# Altium schematic sheet INV.5KW.OffGrid MPS.SchDoc
size 800 x 800 mm
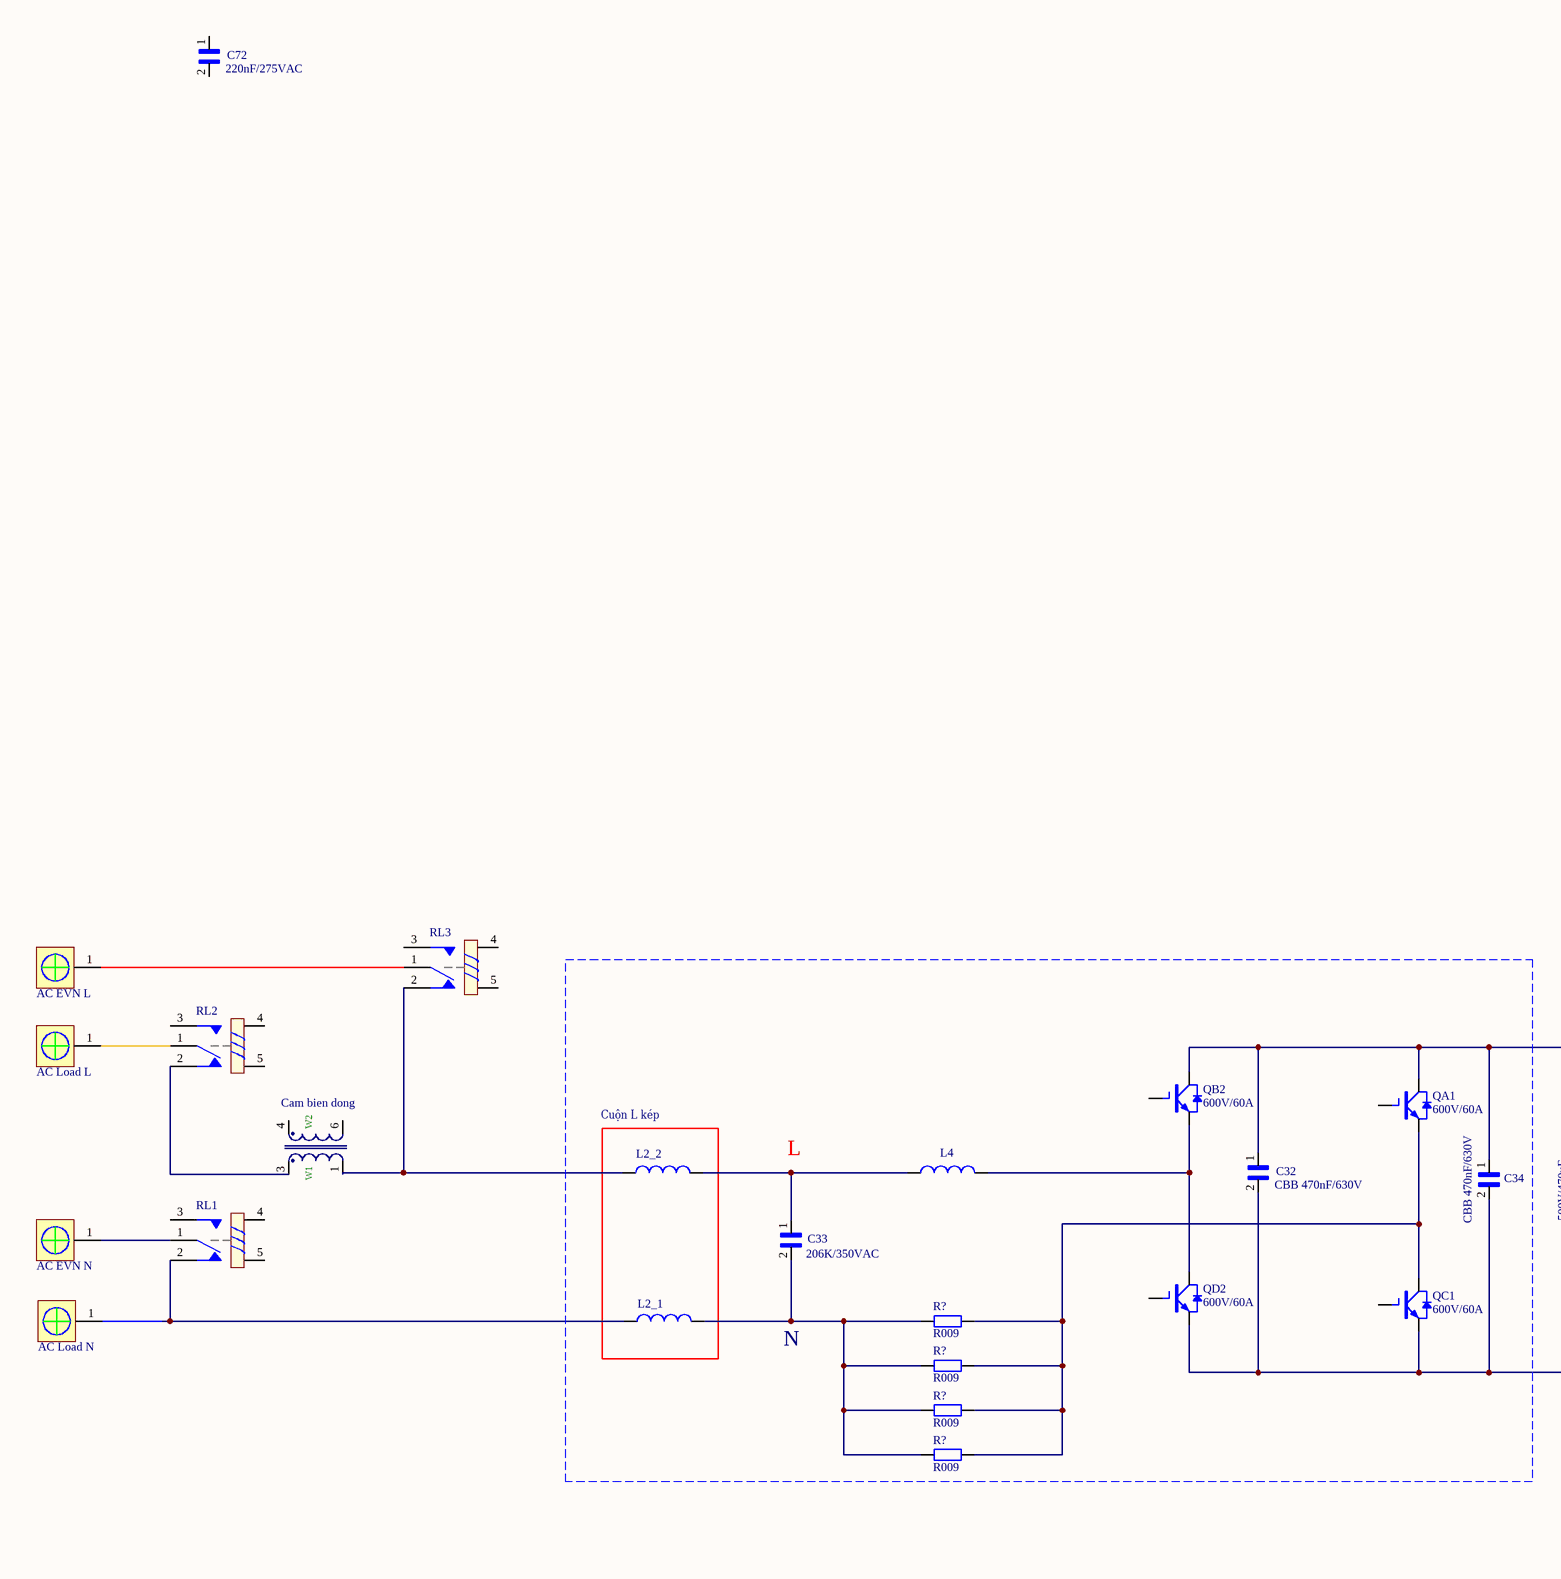
[diagram p0: INV.5KW.OffGrid MPS.SchDoc, left]
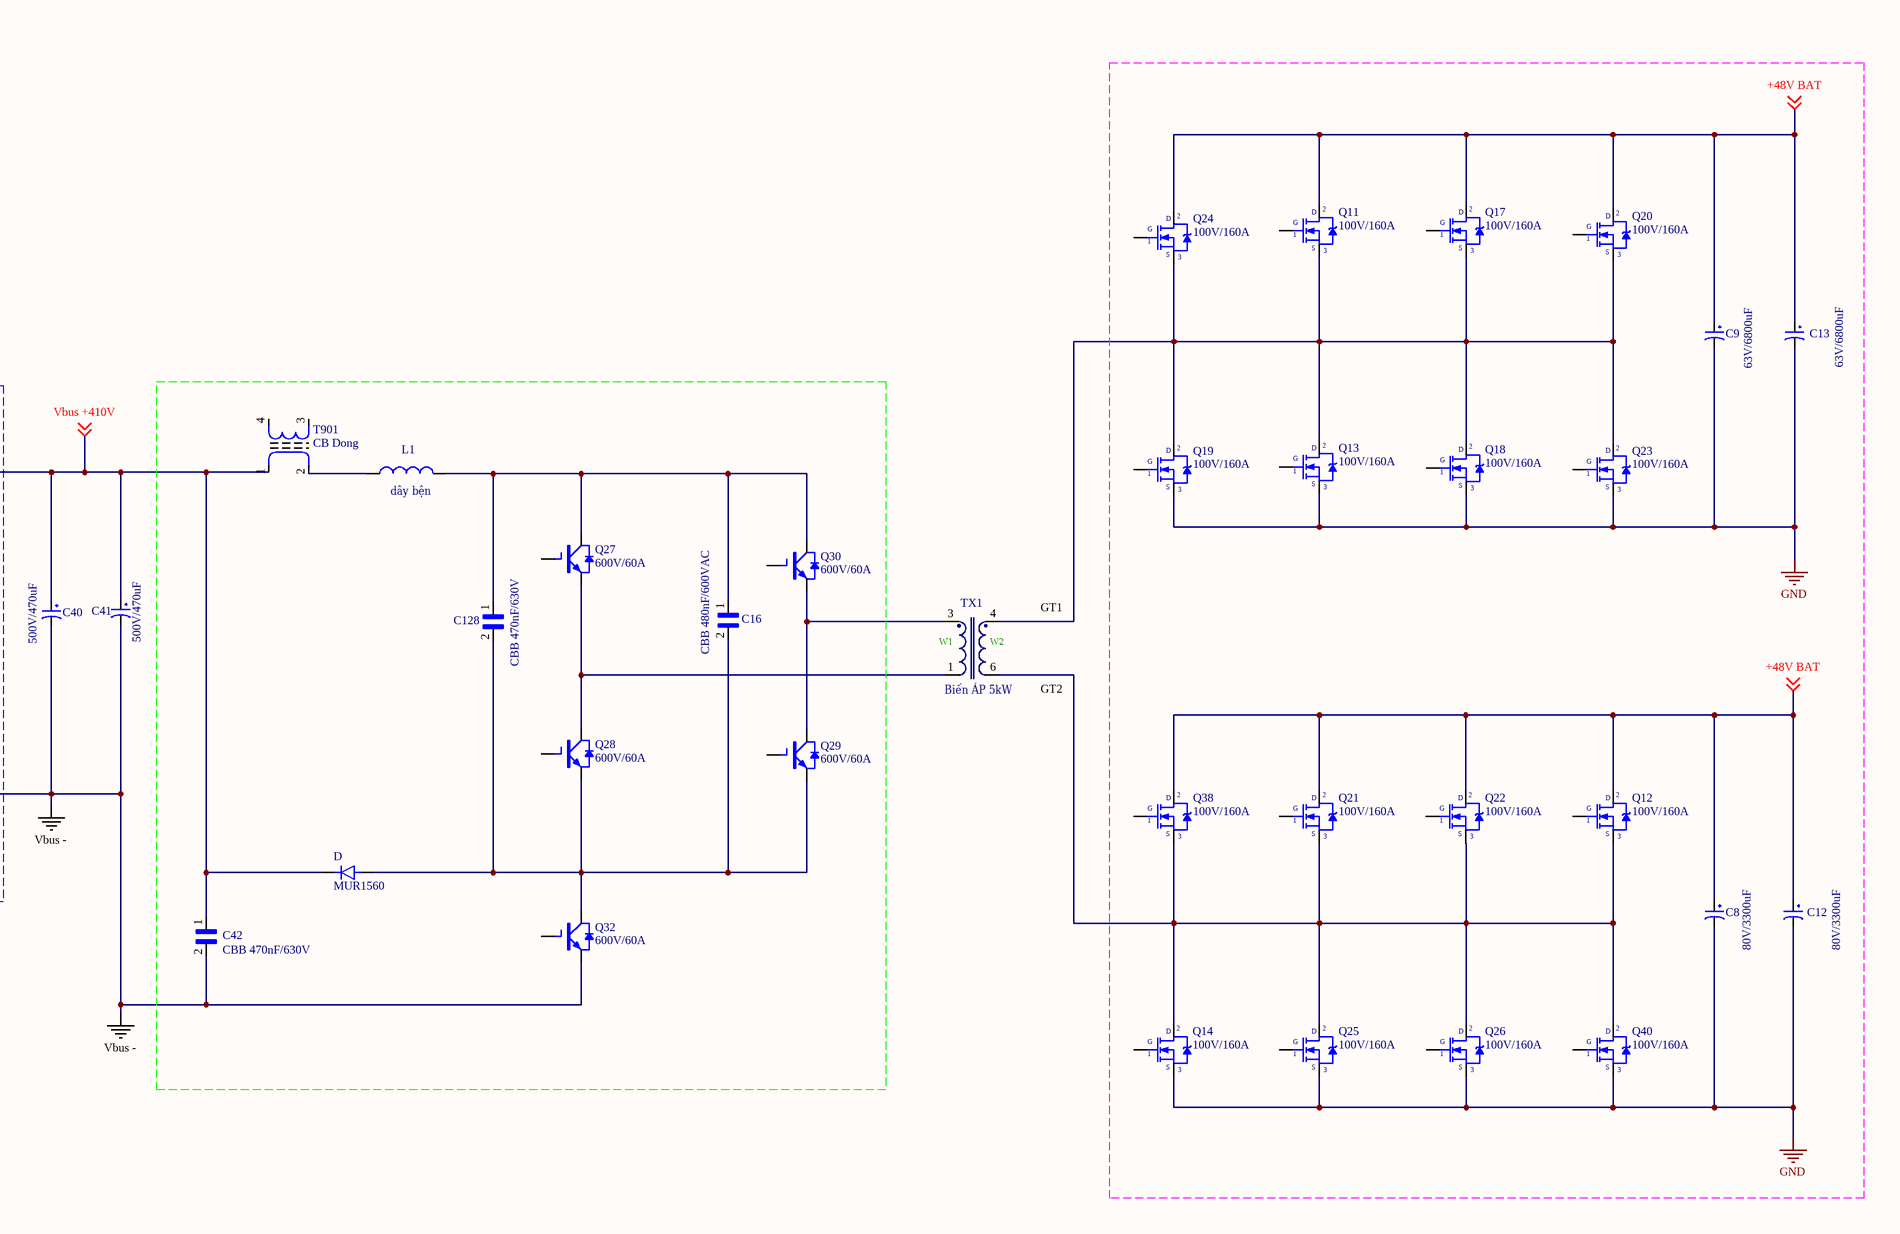
[diagram p1: INV.5KW.OffGrid MPS.SchDoc, right]

## Parts
(Parts that share a designator on the sheet are numbered #1, #2 ... from top to bottom, then left to right.)
?#1  AC EVN L  [Copper Pipe]
?#2  AC Load L  [Copper Pipe]
?#3  Cam bien dong  [EE13/7/4-Vertical/(EF12.6)]
?#4  AC EVN N  [Copper Pipe]
?#5  AC Load N  [Copper Pipe]
C8  80V/3300uF  [CAP-10X17-N]
C9  63V/6800uF  [CAP-10X17-N]
C12  80V/3300uF  [CAP-10X17-N]
C13  63V/6800uF  [CAP-10X17-N]
C16  CBB 480nF/600VAC  [CAPRR2250W80L2600T850H1500]
C32  CBB 470nF/630V  [CAPRR2250W80L2600T850H1500]
C33  206K/350VAC  [CAPRR2250W80L2600T850H1500]
C34  CBB 470nF/630V  [CAPRR2250W80L2600T850H1500]
C40  500V/470uF  [CAP-10X17-N]
C41  500V/470uF  [CAP-10X17-N]
C42  CBB 470nF/630V  [CAPRR2250W80L2600T850H1500]
C72  220nF/275VAC  [CAPRR2250W80L2600T850H1500]
C128  CBB 470nF/630V  [CAPRR2250W80L2600T850H1500]
D  MUR1560  [TO-220AC-2]
L1  dây bện  [IND_1210]
L2_1  (no value)  [IND_1210]
L2_2  (no value)  [IND_1210]
L4  Cuộn L  [IND_1210]  (value not drawn)
Q11  100V/160A  [TO220H1]
Q12  100V/160A  [TO220H1]
Q13  100V/160A  [TO220H1]
Q14  100V/160A  [TO220H1]
Q17  100V/160A  [TO220H1]
Q18  100V/160A  [TO220H1]
Q19  100V/160A  [TO220H1]
Q20  100V/160A  [TO220H1]
Q21  100V/160A  [TO220H1]
Q22  100V/160A  [TO220H1]
Q23  100V/160A  [TO220H1]
Q24  100V/160A  [TO220H1]
Q25  100V/160A  [TO220H1]
Q26  100V/160A  [TO220H1]
Q27  600V/60A  [TO-3P]
Q28  600V/60A  [TO-3P]
Q29  600V/60A  [TO-3P]
Q30  600V/60A  [TO-3P]
Q32  600V/60A  [TO-3P]
Q38  100V/160A  [TO220H1]
Q40  100V/160A  [TO220H1]
QA1  600V/60A  [TO-3P]
QB2  600V/60A  [TO-3P]
QC1  600V/60A  [TO-3P]
QD2  600V/60A  [TO-3P]
R?#1  R009  [tro vach 3w]
R?#2  R009  [tro vach 3w]
R?#3  R009  [tro vach 3w]
R?#4  R009  [tro vach 3w]
RL1  (no value)  [Relay 5 Chan SRD]
RL2  (no value)  [Relay 5 Chan SRD]
RL3  (no value)  [Relay 5 Chan SRD]
T901  CB Dong  [Bien ap do Current]
TX1  Biến ÁP 5kW  [EE13/7/4-Vertical/(EF12.6)]

## Sub-sheets
Cuộn L kép = ?: no entries

## Nets
GND: C8.2 C9.2 C12.2 C13.2 Q13.3(S) Q14.3(S) Q18.3(S) Q19.3(S) Q23.3(S) Q25.3(S) Q26.3(S) Q40.3(S)
Vbus -: C32.2 C34.2 C40.2 C41.2 C42.2 Q32.3(E) QC1.3(E) QD2.3(E)
+48V BAT: C8.1 C9.1 C12.1 C13.1 Q11.2(D) Q12.2(D) Q17.2(D) Q20.2(D) Q21.2(D) Q22.2(D) Q24.2(D) Q38.2(D) ; off-sheet +48V BAT
Vbus +410V: C32.1 C34.1 C40.1 C41.1 C42.1 D.1(K) QA1.2(C) QB2.2(C) T901.1 ; off-sheet Vbus +410V
Net?#1_1: ?#1.1 RL3.1
Net?#2_1: ?#2.1 RL2.1
Net?#3_1: ?#3.1 L2_2.1 RL3.2
Net?#3_3: ?#3.3 RL2.2
Net?#4_1: ?#4.1 RL1.1
Net?#5_1: ?#5.1 L2_1.1 RL1.2
NetC16_1: C16.1 C128.1 L1.2 Q27.2(C) Q30.2(C)
NetC16_2: C16.2 C128.2 D.3(A) Q28.3(E) Q29.3(E) Q32.2(C)
NetC33_1: C33.1 L2_2.2 L4.1
NetC33_2: C33.2 L2_1.2 R?#1.1 R?#2.1 R?#3.1 R?#4.1
NetL1_1: L1.1 T901.2
NetL4_2: L4.2 QB2.3(E) QD2.2(C)
NetQ11_3: Q11.3(S) Q13.2(D) Q17.3(S) Q18.2(D) Q19.2(D) Q20.3(S) Q23.2(D) Q24.3(S) TX1.4
NetQ12_3: Q12.3(S) Q14.2(D) Q21.3(S) Q22.3(S) Q25.2(D) Q26.2(D) Q38.3(S) Q40.2(D) TX1.6
NetQ27_3: Q27.3(E) Q28.2(C) TX1.1
NetQ29_2: Q29.2(C) Q30.3(E) TX1.3
NetQA1_3: QA1.3(E) QC1.2(C) R?#1.2 R?#2.2 R?#3.2 R?#4.2

Not connected (* = marked no-connect by the designer): ?#3 4 6; C72 1 2; Q11 1(G); Q12 1(G); Q13 1(G); Q14 1(G); Q17 1(G); Q18 1(G); Q19 1(G); Q20 1(G); Q21 1(G); Q22 1(G); Q23 1(G); Q24 1(G); Q25 1(G); Q26 1(G); Q27 1(G); Q28 1(G); Q29 1(G); Q30 1(G); Q32 1(G); Q38 1(G); Q40 1(G); QA1 1(G); QB2 1(G); QC1 1(G); QD2 1(G); RL1 3 4 5; RL2 3 4 5; RL3 3 4 5; T901 3 4

## Notes on the sheet
- L
- GT1
- GT2
- N
- (in symbol Tranf7) W2; W1

## Library data of the parts
?#1 ?#2 ?#4 ?#5 = Copper
?#3 TX1 = Tranf7: Off-Line Transformer WE-UNIT , L=2.8mH; PartNo: 7491181012; Manufacturer: Würth Elektronik eiSos GmbH; Inductance: 2.8mH; Turns Ratio: 8.1:1; Input Voltage (AC): 85-265; Output Current (A): 0.25; Output Voltage (DC): 12; ComponentLink1Description: Manufacturer; ComponentLink1URL: http://www.we-online.de; Created by: Otto Christin; Created Date: OCT 2013; ComponentLink2Description: Datasheet; ComponentLink2URL: http://www.we-online.de/katalog/media/pdf/7491181012.pdf
C8 C9 C12 C13 C40 C41 = Cap - 10x18 - N: Cắm; Don_Vi: Con; So_Chan: 2; Ten_Linh_Kien: Tụ Hóa 220uF 10V 6x11MM; Ma_Hang: MH004510; Chung_Loai: Cắm; Kieu_Chan: *
C16 C32-C34 C42 C128 = ECWFG2J475KA: Metallized Polypropylene Film Capacitor; MF: Panasonic; Value: *; Price: None; Package: MOLDED-2 Panasonic; MP: ECWFG2J475KA; Availability: In Stock; Check_prices: https://www.snapeda.com/parts/ECWFG2J475KA/Panasonic/view-part/?ref=eda; SnapEDA_Link: https://www.snapeda.com/parts/ECWFG2J475KA/Panasonic/view-part/?ref=snap
C72 = ECWFG2J475KA: Film Capacitor Film 220nF/275VAC; MF: Panasonic; Value: *; Price: None; Package: MOLDED-2 Panasonic; MP: ECWFG2J475KA; Availability: In Stock; Check_prices: https://www.snapeda.com/parts/ECWFG2J475KA/Panasonic/view-part/?ref=eda; SnapEDA_Link: https://www.snapeda.com/parts/ECWFG2J475KA/Panasonic/view-part/?ref=snap
D = MUR1560: Diode Standard 600V 15A Through Hole TO-220AC; MF: ON Semiconductor; Arrow_Electronics-Purchase-URL: https://snapeda.com/shop?store=Arrow+Electronics&id=621574; Value: *; SnapEDA_Link: https://www.snapeda.com/parts/MUR1560/ON%20Semiconductor/view-part/621574/?ref=snap; Package: TO-220 ON Semiconductor; MP: MUR1560
L1 L2_1 L2_2 L4 = IND_18uH-0.12A-10%-SMD: Fixed Inductors 18uH 10% 2.52MHz; Manufacturer: Wurth Electronics; Manufacturer Part Number: CMH322522-180KL; Alternate Part Number-1: NA; Case/Package: SMD; Supplier-1: ARROW; Supplier Part Number-1: CMH322522-180KL
Q11-Q14 Q17-Q26 Q38 Q40 = MOSFET IRF N: G042N10 HYG; Value: IRF840
Q27-Q30 Q32 QA1 QB2 QC1 QD2 = FGA25N120ANTD: G60T60AK; MF: ON Semiconductor; Value: *; Digi-Key_Purchase_URL: https://www.digikey.in/product-detail/en/on-semiconductor/FGA25N120ANTDTU/FGA25N120ANTDTU-ND/820640?utm_source=snapeda&utm_medium=aggregator&utm_campaign=symbol; MP: FGA25N120ANTD; Package: TO-3 Fairchild Semiconductor; SnapEDA_Link: https://www.snapeda.com/parts/FGA25N120ANTD/ON%20Semiconductor/view-part/202622/?ref=snap; Digi-Key_Part_Number: FGA25N120ANTDTU-ND
R?#1-R?#4 = Tro Vach 3W 5% 220R: Cắm; Don_Vi: Con; So_Chan: 2; Ten_Linh_Kien: Trở 5% 3w 220R; Ma_Hang: MH004658; Chung_Loai: Cắm; Kieu_Chan: *
RL1-RL3 = Relay 5 Chan SRD: Relay 5 Chan; Ma_Hang: MH009374; Ten: Relay 5V10A SRD-05VDC-SL-C Chính Hãng
T901 = Bien ap dong: Biến áp đo dòng; Value: Loc 220; Designed by: VanDungEvn